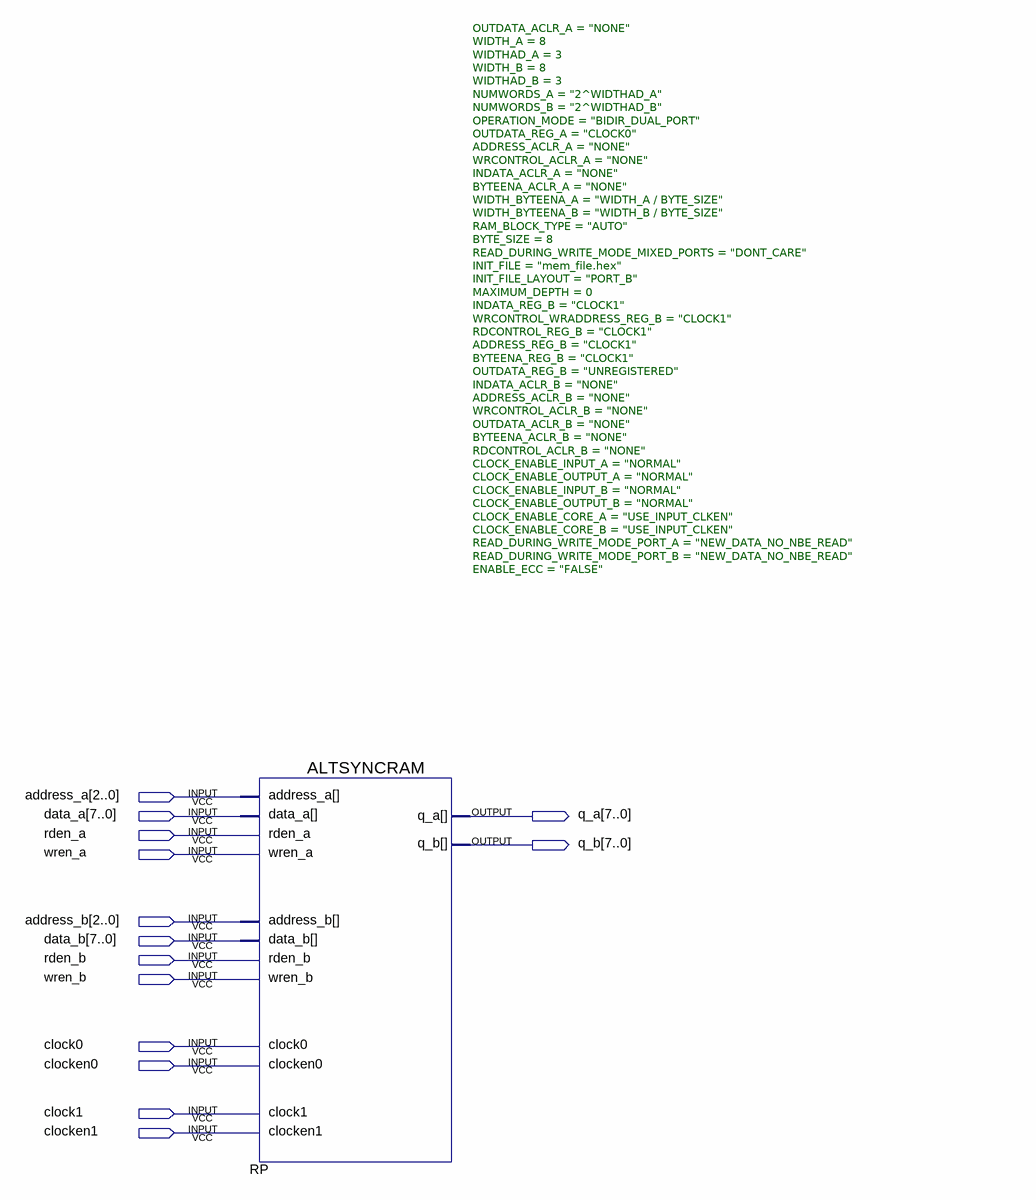
[diagram p0: schematic sheet]
// Quartus schematic Modul_altsyncram.bdf as structural Verilog: 1 symbols, 14 pins
module Modul_altsyncram (
  input  [2:0] address_a,
  input  [7:0] data_a,
  input  rden_a,
  input  wren_a,
  input  [2:0] address_b,
  input  [7:0] data_b,
  input  rden_b,
  input  wren_b,
  input  clock0,
  input  clocken0,
  input  clock1,
  input  clocken1,
  output [7:0] q_a,
  output [7:0] q_b
);

  ALTSYNCRAM #(.OUTDATA_ACLR_A("NONE"), .WIDTH_A(8), .WIDTHAD_A(3), .WIDTH_B(8), .WIDTHAD_B(3), .NUMWORDS_A("2^WIDTHAD_A"), .NUMWORDS_B("2^WIDTHAD_B"), .OPERATION_MODE("BIDIR_DUAL_PORT"), .OUTDATA_REG_A("CLOCK0"), .ADDRESS_ACLR_A("NONE"), .WRCONTROL_ACLR_A("NONE"), .INDATA_ACLR_A("NONE"), .BYTEENA_ACLR_A("NONE"), .WIDTH_BYTEENA_A("WIDTH_A / BYTE_SIZE"), .WIDTH_BYTEENA_B("WIDTH_B / BYTE_SIZE"), .RAM_BLOCK_TYPE("AUTO"), .BYTE_SIZE(8), .READ_DURING_WRITE_MODE_MIXED_PORTS("DONT_CARE"), .INIT_FILE("mem_file.hex"), .INIT_FILE_LAYOUT("PORT_B"), .MAXIMUM_DEPTH(0), .INDATA_REG_B("CLOCK1"), .WRCONTROL_WRADDRESS_REG_B("CLOCK1"), .RDCONTROL_REG_B("CLOCK1"), .ADDRESS_REG_B("CLOCK1"), .BYTEENA_REG_B("CLOCK1"), .OUTDATA_REG_B("UNREGISTERED"), .INDATA_ACLR_B("NONE"), .ADDRESS_ACLR_B("NONE"), .WRCONTROL_ACLR_B("NONE"), .OUTDATA_ACLR_B("NONE"), .BYTEENA_ACLR_B("NONE"), .RDCONTROL_ACLR_B("NONE"), .CLOCK_ENABLE_INPUT_A("NORMAL"), .CLOCK_ENABLE_OUTPUT_A("NORMAL"), .CLOCK_ENABLE_INPUT_B("NORMAL"), .CLOCK_ENABLE_OUTPUT_B("NORMAL"), .CLOCK_ENABLE_CORE_A("USE_INPUT_CLKEN"), .CLOCK_ENABLE_CORE_B("USE_INPUT_CLKEN"), .READ_DURING_WRITE_MODE_PORT_A("NEW_DATA_NO_NBE_READ"), .READ_DURING_WRITE_MODE_PORT_B("NEW_DATA_NO_NBE_READ"), .ENABLE_ECC("FALSE")) RP (
    .address_a(address_a), .wren_a(wren_a), .data_b(data_b), .rden_b(rden_b), .wren_b(wren_b),
    .clock0(clock0), .clocken0(clocken0), .clock1(clock1), .clocken1(clocken1), .data_a(data_a),
    .address_b(address_b), .rden_a(rden_a), .q_a(q_a), .q_b(q_b));
endmodule
